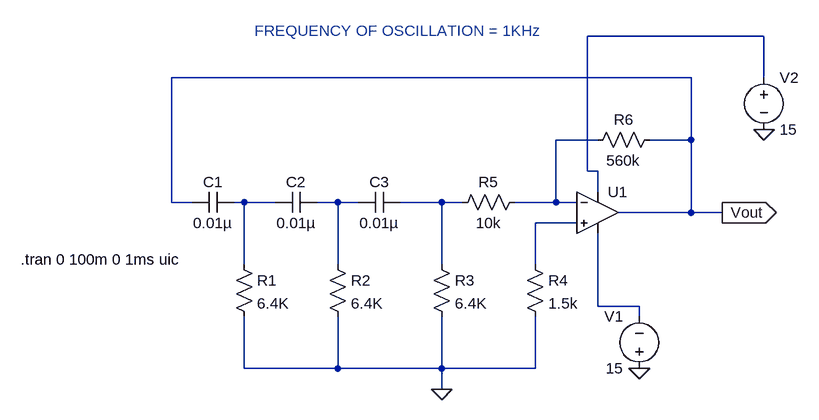
[diagram p0: schematic RC_phase_shift_OSC.asc]
RC_phase_shift_OSC.asc, the LTspice schematic file:
Version 4
SHEET 1 904 680
WIRE 848 -112 576 -112
WIRE 736 -48 -64 -48
WIRE 848 -48 848 -112
WIRE 592 48 528 48
WIRE 736 48 736 -48
WIRE 736 48 672 48
WIRE 576 96 576 -112
WIRE 592 96 576 96
WIRE 592 128 592 96
WIRE -64 144 -64 -48
WIRE -32 144 -64 144
WIRE 48 144 32 144
WIRE 96 144 48 144
WIRE 192 144 160 144
WIRE 224 144 192 144
WIRE 352 144 288 144
WIRE 384 144 352 144
WIRE 528 144 528 48
WIRE 528 144 464 144
WIRE 560 144 528 144
WIRE 736 160 736 48
WIRE 736 160 624 160
WIRE 784 160 736 160
WIRE 560 176 496 176
WIRE 48 240 48 144
WIRE 192 240 192 144
WIRE 352 240 352 144
WIRE 496 240 496 176
WIRE 592 304 592 192
WIRE 656 304 592 304
WIRE 656 320 656 304
WIRE 48 400 48 320
WIRE 192 400 192 320
WIRE 192 400 48 400
WIRE 352 400 352 320
WIRE 352 400 192 400
WIRE 496 400 496 320
WIRE 496 400 352 400
WIRE 352 432 352 400
FLAG 352 432 0
FLAG 656 400 0
FLAG 848 32 0
FLAG 784 160 Vout
IOPIN 784 160 Out
SYMBOL cap 32 128 R90
WINDOW 0 0 32 VBottom 2
WINDOW 3 32 32 VTop 2
SYMATTR InstName C1
SYMATTR Value 0.01µ
SYMBOL cap 160 128 R90
WINDOW 0 0 32 VBottom 2
WINDOW 3 32 32 VTop 2
SYMATTR InstName C2
SYMATTR Value 0.01µ
SYMBOL cap 288 128 R90
WINDOW 0 0 32 VBottom 2
WINDOW 3 32 32 VTop 2
SYMATTR InstName C3
SYMATTR Value 0.01µ
SYMBOL res 32 224 R0
SYMATTR InstName R1
SYMATTR Value 6.4K
SYMBOL res 336 224 R0
SYMATTR InstName R3
SYMATTR Value 6.4K
SYMBOL res 480 128 R90
WINDOW 0 0 56 VBottom 2
WINDOW 3 32 56 VTop 2
SYMATTR InstName R5
SYMATTR Value 10k
SYMBOL OpAmps\\UniversalOpamp2 592 160 R0
SYMATTR InstName U1
SYMBOL res 688 32 R90
WINDOW 0 0 56 VBottom 2
WINDOW 3 32 56 VTop 2
SYMATTR InstName R6
SYMATTR Value 560k
SYMBOL res 176 224 R0
SYMATTR InstName R2
SYMATTR Value 6.4K
SYMBOL res 480 224 R0
SYMATTR InstName R4
SYMATTR Value 1.5k
SYMBOL voltage 656 416 R180
WINDOW 0 24 96 Left 2
WINDOW 3 24 16 Left 2
WINDOW 123 0 0 Left 0
WINDOW 39 0 0 Left 0
SYMATTR InstName V1
SYMATTR Value 15
SYMBOL voltage 848 -64 R0
WINDOW 123 0 0 Left 0
WINDOW 39 0 0 Left 0
SYMATTR InstName V2
SYMATTR Value 15
TEXT -296 232 Left 2 !.tran 0 100m 0 1ms uic
TEXT 64 -120 Left 2 ;FREQUENCY OF OSCILLATION = 1KHz

The netlist it stands for:
* RC_phase_shift_OSC.asc
C1 N003 Vout 0.01µ
C2 N004 N003 0.01µ
C3 N005 N004 0.01µ
R1 N003 0 6.4K
R3 N005 0 6.4K
R5 N002 N005 10k
XU1 N006 N002 N001 N007 Vout level.2 Avol=1Meg GBW=10Meg Slew=10Meg ilimit=25m rail=0 Vos=0 phimargin=45 en=0 enk=0 in=0 ink=0 Rin=500Meg  ; pins IN+ IN- V+ V- OUT
R6 Vout N002 560k
R2 N004 0 6.4K
R4 N006 0 1.5k
V1 0 N007 15
V2 N001 0 15
.tran 0 100m 0 1ms uic
* FREQUENCY OF OSCILLATION = 1KHz
.lib UniversalOpamps2.sub
.backanno
.end